# EAGLE design M220xc (EAGLE 6.6.0)
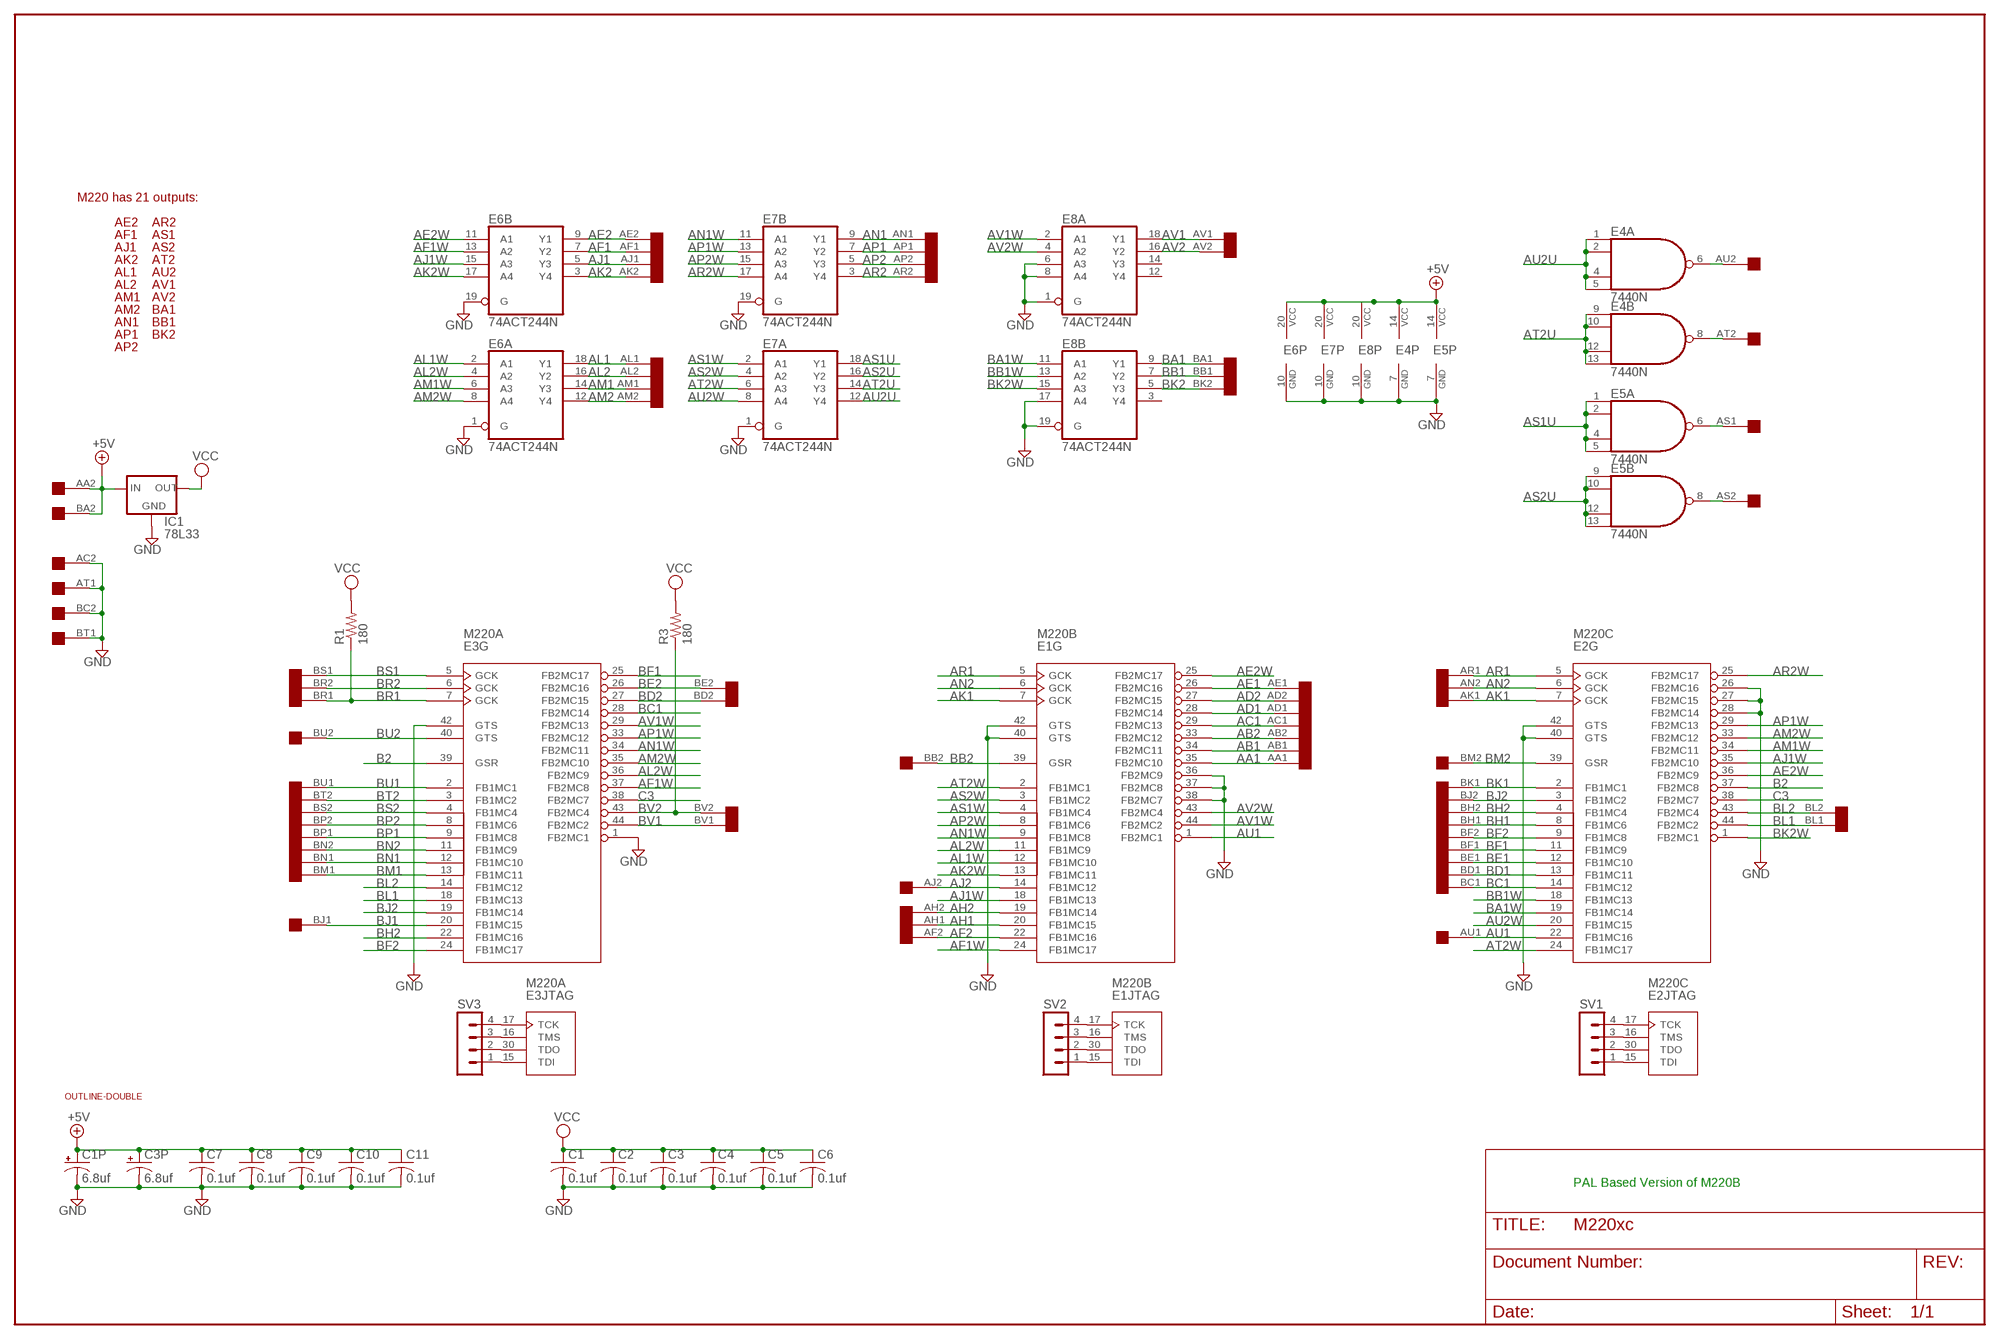
[diagram p0: schematic, sheet 1]

## Parts
C1  0.1uf  C-US050-025X075  [C050-025X075]
C1P  6.8uf  CPOL-USE15-5AXIAL  [E15-5]
C2  0.1uf  C-US050-025X075  [C050-025X075]
C3  0.1uf  C-US050-025X075  [C050-025X075]
C3P  6.8uf  CPOL-USE15-5AXIAL  [E15-5]
C4  0.1uf  C-US050-025X075  [C050-025X075]
C5  0.1uf  C-US050-025X075  [C050-025X075]
C6  0.1uf  C-US050-025X075  [C050-025X075]
C7  0.1uf  C-US050-025X075  [C050-025X075]
C8  0.1uf  C-US050-025X075  [C050-025X075]
C9  0.1uf  C-US050-025X075  [C050-025X075]
C10  0.1uf  C-US050-025X075  [C050-025X075]
C11  0.1uf  C-US050-025X075  [C050-025X075]
E1  M220B  XC9536-44  [PLCC-S44]
E2  M220C  XC9536-44  [PLCC-S44]
E3  M220A  XC9536-44  [PLCC-S44]
E4  7440N  74S20N  [DIL14]
E5  7440N  74S20N  [DIL14]
E6  74ACT244N  74S244N  [DIL20]
E7  74ACT244N  74S244N  [DIL20]
E8  74ACT244N  74S244N  [DIL20]
IC1  78L33  78LXX  [78LXX]
R1  180  R-US_0207/10  [0207/10]
R3  180  R-US_0207/10  [0207/10]
SV1  MA04-1  [MA04-1]
SV2  MA04-1  [MA04-1]
SV3  MA04-1  [MA04-1]
U$1  DOUBLE  [EDGE-CON4]
U$2  OUTLINE-DOUBLE  [DOUBLE]

## Nets
+5V [Supply]: C1P.+ C3P.+ C7.1 C8.1 C9.1 C10.1 C11.1 E4.14(P:VCC) E5.14(P:VCC) E6.20(P:VCC) E7.20(P:VCC) E8.20(P:VCC) IC1.IN U$1.AA2 U$1.BA2
AA1: E1.35(G:FB2MC10) U$1.AA1
AB1: E1.34(G:FB2MC11) U$1.AB1
AB2: E1.33(G:FB2MC12) U$1.AB2
AC1: E1.29(G:FB2MC13) U$1.AC1
AD1: E1.28(G:FB2MC14) U$1.AD1
AD2: E1.27(G:FB2MC15) U$1.AD2
AE1: E1.26(G:FB2MC16) U$1.AE1
AE2: E6.9(B:Y1) U$1.AE2
AE2W: E1.25(G:FB2MC17) E2.36(G:FB2MC9) E6.11(B:A1)
AF1: E6.7(B:Y2) U$1.AF1
AF1W: E1.24(G:FB1MC17) E3.37(G:FB2MC8) E6.13(B:A2)
AF2: E1.22(G:FB1MC16) U$1.AF2
AH1: E1.20(G:FB1MC15) U$1.AH1
AH2: E1.19(G:FB1MC14) U$1.AH2
AJ1: E6.5(B:Y3) U$1.AJ1
AJ1W: E1.18(G:FB1MC13) E2.35(G:FB2MC10) E6.15(B:A3)
AJ2: E1.14(G:FB1MC12) U$1.AJ2
AK1: E1.7(G:GCK) E2.7(G:GCK) U$1.AK1
AK2: E6.3(B:Y4) U$1.AK2
AK2W: E1.13(G:FB1MC11) E6.17(B:A4)
AL1: E6.18(A:Y1) U$1.AL1
AL1W: E1.12(G:FB1MC10) E6.2(A:A1)
AL2: E6.16(A:Y2) U$1.AL2
AL2W: E1.11(G:FB1MC9) E3.36(G:FB2MC9) E6.4(A:A2)
AM1: E6.14(A:Y3) U$1.AM1
AM1W: E2.34(G:FB2MC11) E6.6(A:A3)
AM2: E6.12(A:Y4) U$1.AM2
AM2W: E2.33(G:FB2MC12) E3.35(G:FB2MC10) E6.8(A:A4)
AN1: E7.9(B:Y1) U$1.AN1
AN1W: E1.9(G:FB1MC8) E3.34(G:FB2MC11) E7.11(B:A1)
AN2: E1.6(G:GCK) E2.6(G:GCK) U$1.AN2
AP1: E7.7(B:Y2) U$1.AP1
AP1W: E2.29(G:FB2MC13) E3.33(G:FB2MC12) E7.13(B:A2)
AP2: E7.5(B:Y3) U$1.AP2
AP2W: E1.8(G:FB1MC6) E7.15(B:A3)
AR1: E1.5(G:GCK) E2.5(G:GCK) U$1.AR1
AR2: E7.3(B:Y4) U$1.AR2
AR2W: E2.25(G:FB2MC17) E7.17(B:A4)
AS1: E5.6(A:O) U$1.AS1
AS1U: E5.1(A:I0) E5.2(A:I1) E5.4(A:I2) E5.5(A:I3) E7.18(A:Y1)
AS1W: E1.4(G:FB1MC4) E7.2(A:A1)
AS2: E5.8(B:O) U$1.AS2
AS2U: E5.9(B:I0) E5.10(B:I1) E5.12(B:I2) E5.13(B:I3) E7.16(A:Y2)
AS2W: E1.3(G:FB1MC2) E7.4(A:A2)
AT2: E4.8(B:O) U$1.AT2
AT2U: E4.9(B:I0) E4.10(B:I1) E4.12(B:I2) E4.13(B:I3) E7.14(A:Y3)
AT2W: E1.2(G:FB1MC1) E2.24(G:FB1MC17) E7.6(A:A3)
AU1: E1.1(G:FB2MC1) E2.22(G:FB1MC16) U$1.AU1
AU2: E4.6(A:O) U$1.AU2
AU2U: E4.1(A:I0) E4.2(A:I1) E4.4(A:I2) E4.5(A:I3) E7.12(A:Y4)
AU2W: E2.20(G:FB1MC15) E7.8(A:A4)
AV1: E8.18(A:Y1) U$1.AV1
AV1W: E1.44(G:FB2MC2) E3.29(G:FB2MC13) E8.2(A:A1)
AV2: E8.16(A:Y2) U$1.AV2
AV2W: E1.43(G:FB2MC4) E8.4(A:A2)
B2: E2.37(G:FB2MC8) E3.39(G:GSR)
BA1: E8.9(B:Y1) U$1.BA1
BA1W: E2.19(G:FB1MC14) E8.11(B:A1)
BB1: E8.7(B:Y2) U$1.BB1
BB1W: E2.18(G:FB1MC13) E8.13(B:A2)
BB2: E1.39(G:GSR) U$1.BB2
BC1: E2.14(G:FB1MC12) E3.28(G:FB2MC14) U$1.BC1
BD1: E2.13(G:FB1MC11) U$1.BD1
BD2: E3.27(G:FB2MC15) U$1.BD2
BE1: E2.12(G:FB1MC10) U$1.BE1
BE2: E3.26(G:FB2MC16) U$1.BE2
BF1: E2.11(G:FB1MC9) E3.25(G:FB2MC17) U$1.BF1
BF2: E2.9(G:FB1MC8) E3.24(G:FB1MC17) U$1.BF2
BH1: E2.8(G:FB1MC6) U$1.BH1
BH2: E2.4(G:FB1MC4) E3.22(G:FB1MC16) U$1.BH2
BJ1: E3.20(G:FB1MC15) U$1.BJ1
BJ2: E2.3(G:FB1MC2) E3.19(G:FB1MC14) U$1.BJ2
BK1: E2.2(G:FB1MC1) U$1.BK1
BK2: E8.5(B:Y3) U$1.BK2
BK2W: E2.1(G:FB2MC1) E8.15(B:A3)
BL1: E2.44(G:FB2MC2) E3.18(G:FB1MC13) U$1.BL1
BL2: E2.43(G:FB2MC4) E3.14(G:FB1MC12) U$1.BL2
BM1: E3.13(G:FB1MC11) U$1.BM1
BM2: E2.39(G:GSR) U$1.BM2
BN1: E3.12(G:FB1MC10) U$1.BN1
BN2: E3.11(G:FB1MC9) U$1.BN2
BP1: E3.9(G:FB1MC8) U$1.BP1
BP2: E3.8(G:FB1MC6) U$1.BP2
BR1: E3.7(G:GCK) R1.1 U$1.BR1
BR2: E3.6(G:GCK) U$1.BR2
BS1: E3.5(G:GCK) U$1.BS1
BS2: E3.4(G:FB1MC4) U$1.BS2
BT2: E3.3(G:FB1MC2) U$1.BT2
BU1: E3.2(G:FB1MC1) U$1.BU1
BU2: E3.40(G:GTS) U$1.BU2
BV1: E3.44(G:FB2MC2) U$1.BV1
BV2: E3.43(G:FB2MC4) R3.1 U$1.BV2
C3: E2.38(G:FB2MC7) E3.38(G:FB2MC7)
GND [Supply]: C1.2 C1P.- C2.2 C3.2 C3P.- C4.2 C5.2 C6.2 C7.2 C8.2 C9.2 C10.2 C11.2 E1.36(G:FB2MC9) E1.37(G:FB2MC8) E1.38(G:FB2MC7) E1.40(G:GTS) E1.42(G:GTS) E2.26(G:FB2MC16) E2.27(G:FB2MC15) E2.28(G:FB2MC14) E2.40(G:GTS) E2.42(G:GTS) E3.1(G:FB2MC1) E3.42(G:GTS) E4.7(P:GND) E5.7(P:GND) E6.1(A:G) E6.10(P:GND) E6.19(B:G) E7.1(A:G) E7.10(P:GND) E7.19(B:G) E8.1(A:G) E8.6(A:A3) E8.8(A:A4) E8.10(P:GND) E8.17(B:A4) E8.19(B:G) IC1.GND U$1.AC2 U$1.AT1 U$1.BC2 U$1.BT1
N$1: E1.15(JTAG:TDI) SV2.1
N$2: E1.30(JTAG:TDO) SV2.2
N$3: E2.15(JTAG:TDI) SV1.1
N$4: E1.16(JTAG:TMS) SV2.3
N$5: E2.30(JTAG:TDO) SV1.2
N$6: E2.16(JTAG:TMS) SV1.3
N$7: E2.17(JTAG:TCK) SV1.4
N$8: E1.17(JTAG:TCK) SV2.4
N$9: E3.15(JTAG:TDI) SV3.1
N$10: E3.30(JTAG:TDO) SV3.2
N$11: E3.16(JTAG:TMS) SV3.3
N$12: E3.17(JTAG:TCK) SV3.4
VCC [Supply]: C1.1 C2.1 C3.1 C4.1 C5.1 C6.1 IC1.OUT R1.2 R3.2
Unconnected: E8.3(B:Y4) E8.12(A:Y4) E8.14(A:Y3)

## Notes on the sheet
- M220 has 21 outputs:
- AE2 | AR2
- AF1 | AS1
- AJ1 | AS2
- AK2 | AT2
- AL1 | AU2
- AL2 | AV1
- AM1 | AV2
- AM2 | BA1
- AN1 | BB1
- AP1 | BK2
- AP2
- PAL Based Version of M220B

## Power pins joined to a net without a drawn wire
GND: E1.10(PWR:GND) E1.23(PWR:GND) E1.31(PWR:GND) E2.10(PWR:GND) E2.23(PWR:GND) E2.31(PWR:GND) E3.10(PWR:GND) E3.23(PWR:GND) E3.31(PWR:GND)
VCC: E1.21(PWR:VCC) E1.32(PWR:VCC) E1.41(PWR:VCC) E2.21(PWR:VCC) E2.32(PWR:VCC) E2.41(PWR:VCC) E3.21(PWR:VCC) E3.32(PWR:VCC) E3.41(PWR:VCC)

## Library data of the parts
C1-C11 = rcl:C-US: CAPACITOR, American symbol
C1P C3P = rcl:CPOL-US: POLARIZED CAPACITOR, American symbol
E1-E3 = dec-con:XC9536-44
E4 E5 = 74xx-us:74*20: Dual 4-input NAND gate
E6-E8 = 74xx-us:74*244: Octal BUFFER and LINE DRIVER, 3-state
IC1 = v-reg:78LXX: VOLTAGE REGULATOR
R1 R3 = rcl:R-US_: RESISTOR, American symbol
SV1-SV3 = con-lstb:MA04-1: PIN HEADER; OC_FARNELL: unknown; OC_NEWARK: unknown
U$1 = dec-con:DOUBLE: Double-Height DEC board
U$2 = dec-con:OUTLINE-*: Board outlines for DEC boards.

## Net classes
1 Supply: width 0.813 mm

## Board
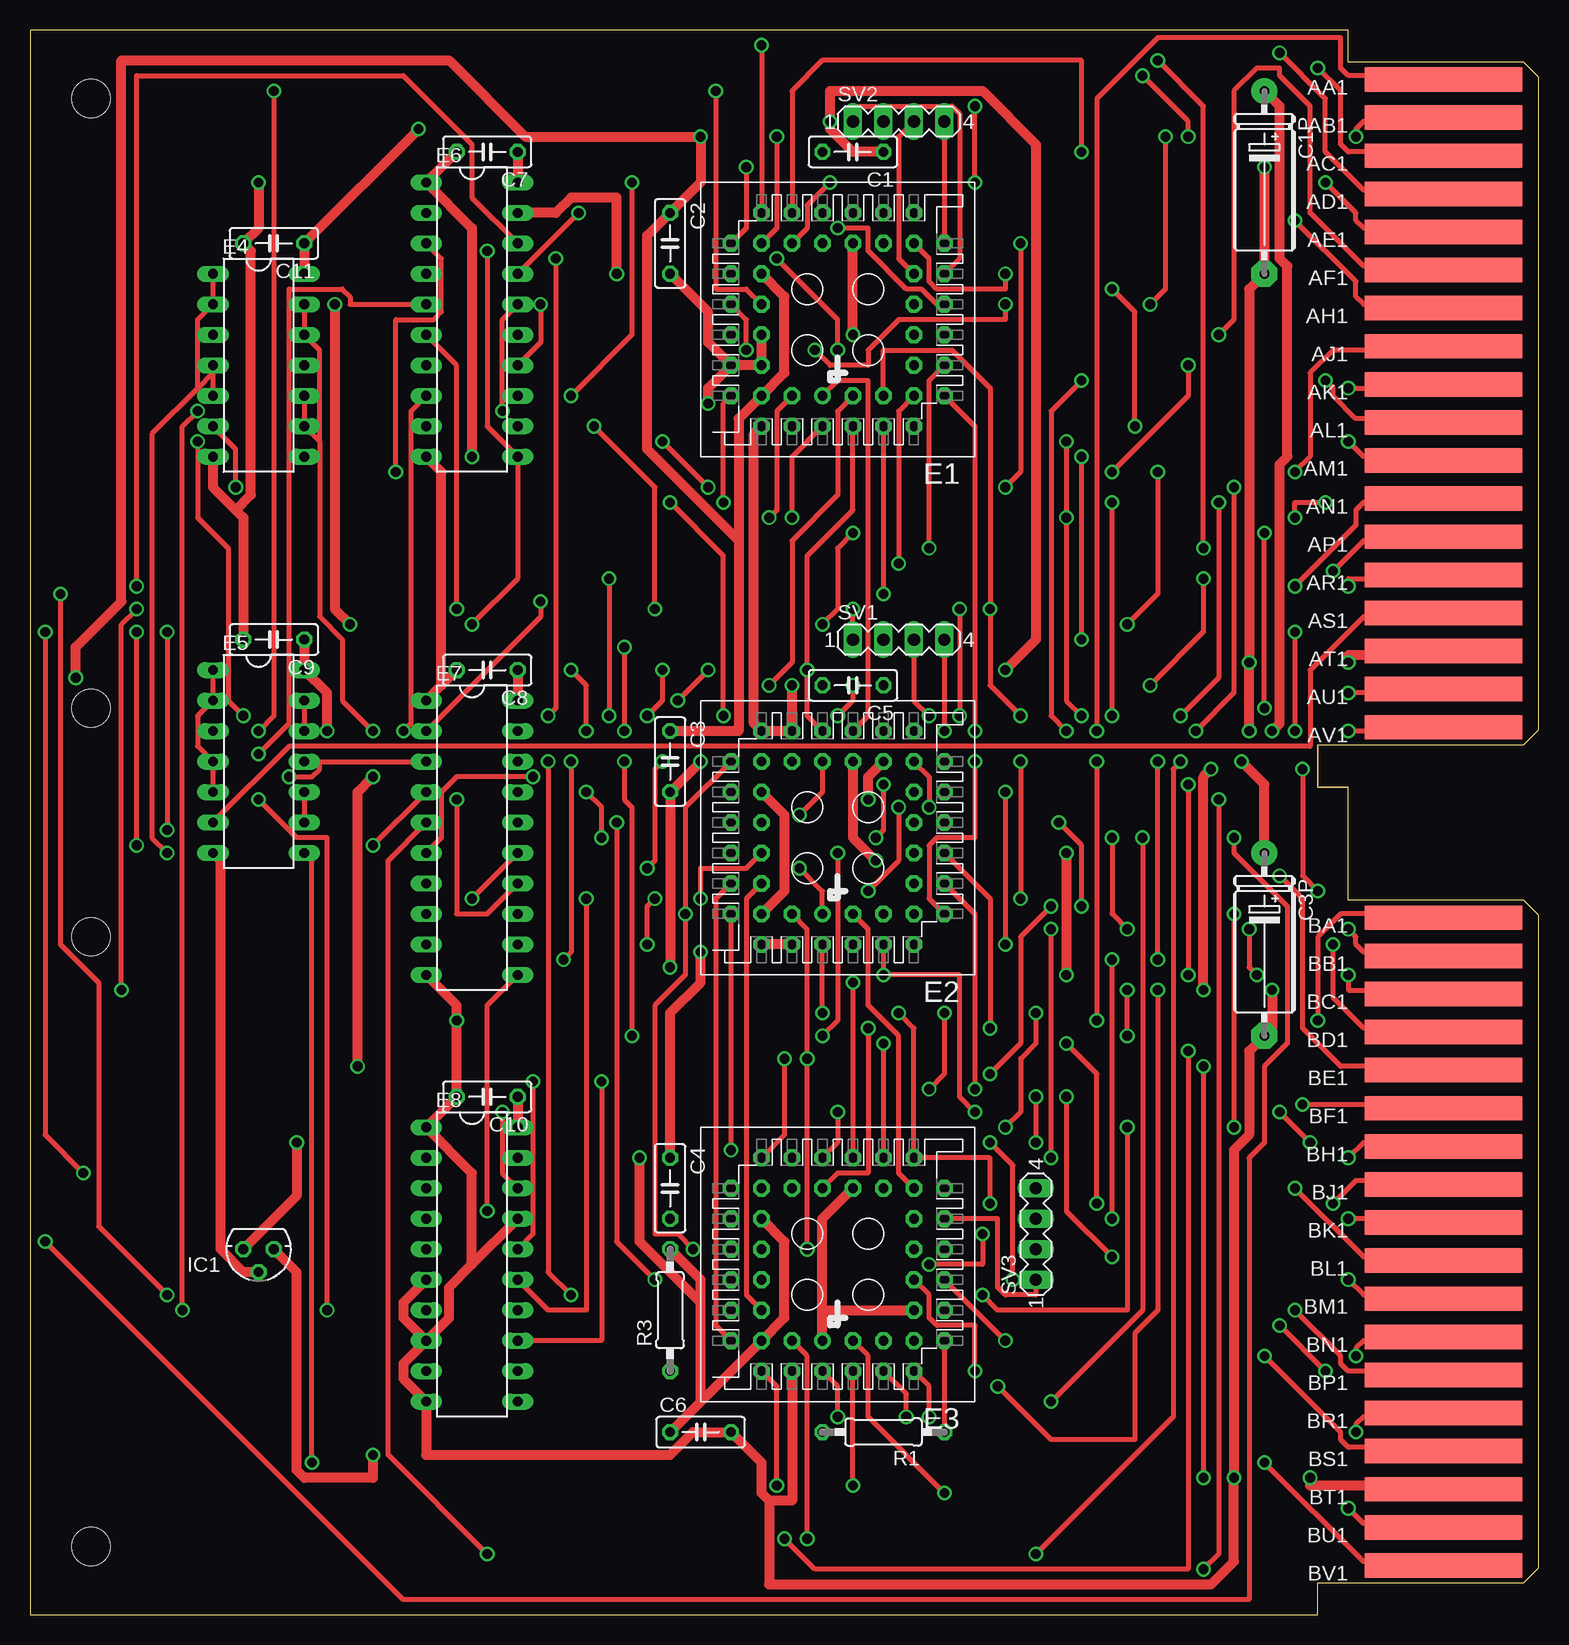
[diagram p1: board, top side]
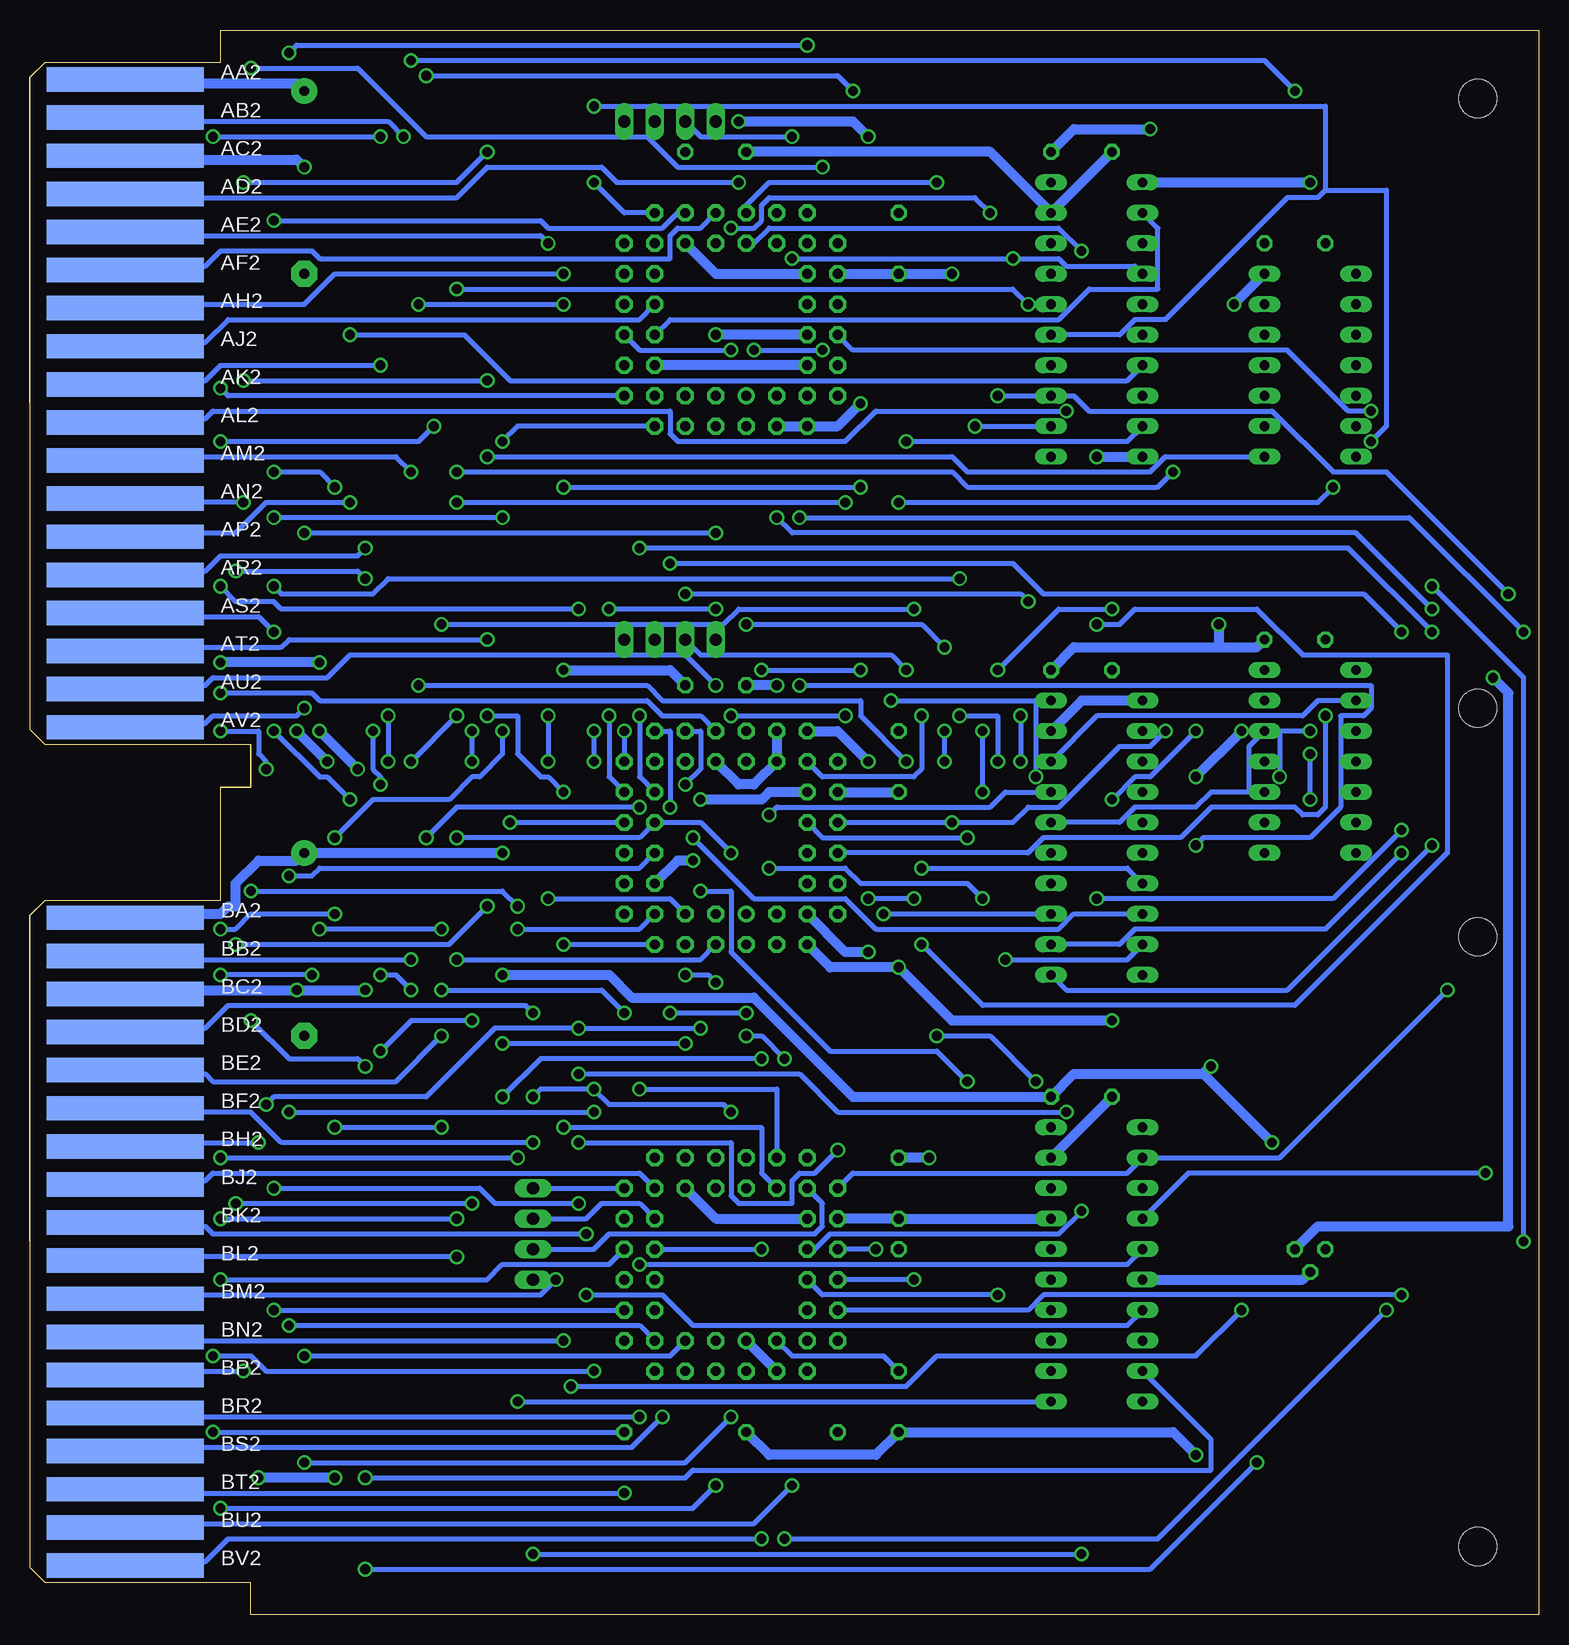
[diagram p2: board, bottom side, seen from below]

Size 125.73 x 132.08 mm. Coordinates in mm from the lower left corner, seen from the top.
Copper layers (1+16): Top 0.035mm / dielectric 1.5mm / Bottom 0.035mm
Design rules "16mils": minimum track width 16mil, minimum drill 32mil, track to track 15mil, track to pad 10mil, pad to pad 10mil, via to via 10mil, smd to smd 10mil, copper to edge 13mil, drill to drill 10mil, minimum pad ring 10mil, minimum via ring 8mil, stop-mask expansion 0mil, vias tented up to drill 0mil, thermal gap 10mil

### Footprints (pad centres in the part's own frame; a part is rotated, then mirrored left to right if it is on the bottom)
C050-025X075 = drill 0.813 octagon: 1 -2.54,0; 2 2.54,0
E15-5 = drill 0.813 pad 2.159: + -7.62,0 | drill 0.813 pad 2.159 octagon: - 7.62,0
PLCC-S44 = drill 0.813 pad 1.397: 1 1.27,6.35 | drill 0.813 pad 1.397 octagon: 2 -1.27,8.89; 3 -1.27,6.35; 4 -3.81,8.89; 5 -3.81,6.35; 6 -6.35,8.89; 7 -8.89,6.35; 8 -6.35,6.35; 9 -8.89,3.81; 10 -6.35,3.81; 11 -8.89,1.27; 12 -6.35,1.27; 13 -8.89,-1.27; 14 -6.35,-1.27; 15 -8.89,-3.81; 16 -6.35,-3.81; 17 -8.89,-6.35; 18 -6.35,-8.89; 19 -6.35,-6.35; 20 -3.81,-8.89; 21 -3.81,-6.35; 22 -1.27,-8.89; 23 -1.27,-6.35; 24 1.27,-8.89; 25 1.27,-6.35; 26 3.81,-8.89; 27 3.81,-6.35; 28 6.35,-8.89; 29 8.89,-6.35; 30 6.35,-6.35; 31 8.89,-3.81; 32 6.35,-3.81; 33 8.89,-1.27; 34 6.35,-1.27; 35 8.89,1.27; 36 6.35,1.27; 37 8.89,3.81; 38 6.35,3.81; 39 8.89,6.35; 40 6.35,8.89; 41 6.35,6.35; 42 3.81,8.89; 43 3.81,6.35; 44 1.27,8.89
DIL14 = drill 0.813 long: 1 -7.62,-3.81; 2 -5.08,-3.81; 3 -2.54,-3.81; 4 0,-3.81; 5 2.54,-3.81; 6 5.08,-3.81; 7 7.62,-3.81; 8 7.62,3.81; 9 5.08,3.81; 10 2.54,3.81; 11 0,3.81; 12 -2.54,3.81; 13 -5.08,3.81; 14 -7.62,3.81
DIL20 = drill 0.813 long: 1 -11.43,-3.81; 2 -8.89,-3.81; 3 -6.35,-3.81; 4 -3.81,-3.81; 5 -1.27,-3.81; 6 1.27,-3.81; 7 3.81,-3.81; 8 6.35,-3.81; 9 8.89,-3.81; 10 11.43,-3.81; 11 11.43,3.81; 12 8.89,3.81; 13 6.35,3.81; 14 3.81,3.81; 15 1.27,3.81; 16 -1.27,3.81; 17 -3.81,3.81; 18 -6.35,3.81; 19 -8.89,3.81; 20 -11.43,3.81
78LXX = drill 0.813 octagon: GND 0,1.905; IN 1.27,0; OUT -1.27,0
0207/10 = drill 0.813 octagon: 1 -5.08,0; 2 5.08,0
MA04-1 = drill 1.016 long: 1 -3.81,0; 2 -1.27,0; 3 1.27,0; 4 3.81,0
EDGE-CON4 = smd 13.106 x 2.032: AA1 7.938,4.128; AB1 7.938,7.303; AC1 7.938,10.477; AD1 7.938,13.652; AE1 7.938,16.828; AF1 7.938,20.003; AH1 7.938,23.177; AJ1 7.938,26.352; AK1 7.938,29.527; AL1 7.938,32.703; AM1 7.938,35.877; AN1 7.938,39.053; AP1 7.938,42.227; AR1 7.938,45.403; AS1 7.938,48.578; AT1 7.938,51.752; AU1 7.938,54.928; AV1 7.938,58.102; BA1 7.938,73.978; BB1 7.938,77.153; BC1 7.938,80.328; BD1 7.938,83.502; BE1 7.938,86.677; BF1 7.938,89.853; BH1 7.938,93.028; BJ1 7.938,96.203; BK1 7.938,99.377; BL1 7.938,102.552; BM1 7.938,105.728; BN1 7.938,108.903; BP1 7.938,112.078; BR1 7.938,115.252; BS1 7.938,118.427; BT1 7.938,121.603; BU1 7.938,124.778; BV1 7.938,127.953 | smd 13.106 x 2.032 bottom: AA2 7.938,4.128; AB2 7.938,7.303; AC2 7.938,10.477; AD2 7.938,13.652; AE2 7.938,16.828; AF2 7.938,20.003; AH2 7.938,23.177; AJ2 7.938,26.352; AK2 7.938,29.527; AL2 7.938,32.703; AM2 7.938,35.877; AN2 7.938,39.053; AP2 7.938,42.227; AR2 7.938,45.403; AS2 7.938,48.578; AT2 7.938,51.752; AU2 7.938,54.928; AV2 7.938,58.102; BA2 7.938,73.978; BB2 7.938,77.153; BC2 7.938,80.328; BD2 7.938,83.502; BE2 7.938,86.677; BF2 7.938,89.853; BH2 7.938,93.028; BJ2 7.938,96.203; BK2 7.938,99.377; BL2 7.938,102.552; BM2 7.938,105.728; BN2 7.938,108.903; BP2 7.938,112.078; BR2 7.938,115.252; BS2 7.938,118.427; BT2 7.938,121.603; BU2 7.938,124.778; BV2 7.938,127.953
DOUBLE = hole 3.175: 120.65,56.515; 120.65,5.715; 120.65,75.565; 120.65,126.365

### Placement (x,y rotation side)
C1  68.58,121.92 180 top
C1P  102.87,119.38 270 top
C2  53.34,114.3 270 top
C3  53.34,71.12 270 top
C3P  102.87,55.88 270 top
C4  53.34,35.56 270 top
C5  68.58,77.47 180 top
C6  55.88,15.24 0 top
C7  38.1,121.92 180 top
C8  38.1,78.74 180 top
C9  20.32,81.28 180 top
C10  38.1,43.18 180 top
C11  20.32,114.3 180 top
E1  67.31,107.95 180 top
E2  67.31,64.77 180 top
E3  67.31,29.21 180 top
E4  19.05,104.14 270 top
E5  19.05,71.12 270 top
E6  36.83,107.95 270 top
E7  36.83,64.77 270 top
E8  36.83,29.21 270 top
IC1  19.05,30.48 180 top
R1  71.12,15.24 180 top
R3  53.34,25.4 90 top
SV1  72.39,81.28 0 top
SV2  72.39,124.46 0 top
SV3  83.82,31.75 90 top
U$1  125.73,132.08 180 top
U$2  125.73,132.08 180 top

### Tracks (layer width: path | path; a pad name or v marks a point on that pad's centre or on a via)
+5V  (via drill 0.81)
  Top 0.813: C9.1 E5.14 24.77,76.83 v24.77,73.66 | C8.1 E7.20 | E4.14 C11.1 v32.38,123.83 | C7.1 E6.20 | v26.67,82.55 25.4,83.82 v25.4,109.22 | IC1.IN 22.23,34.92 v22.23,39.37 | C10.1 E8.20 | v86.36,63.5 v86.36,53.34 | C1P.+ 104.14,125.73 104.14,113.03 104.78,112.39 104.78,96.52 104.14,95.89 104.14,74.3 v103.5,73.66 | v100.97,71.12 102.87,69.22 C3P.+ | v28.57,69.85 27.3,68.58 v27.3,45.72
  Bottom 0.813: C9.1 23.5,80.64 26.67,80.64 | 26.67,80.64 38.73,80.64 C8.1 | v32.38,123.83 38.73,123.83 C7.1 | v26.67,82.55 26.67,80.64 | E4.14 v25.4,109.22 | C1P.+ 103.5,127.64 117.47,127.64 U$1.AA2 | 27.94,45.09 v22.23,39.37 | 27.94,45.09 38.73,45.09 C10.1 57.15,43.18 65.41,51.44 75.56,51.44 77.47,53.34 v86.36,53.34 | U$1.BA2 117.47,58.42 109.86,58.42 109.22,59.05 108.58,59.05 108.58,60.96 106.68,62.87 103.5,62.87 C3P.+ v86.36,63.5 | v100.97,71.12 v103.5,73.66 | v28.57,69.85 v24.77,73.66 | 27.94,45.09 v27.3,45.72
AA1  (via drill 0.81)
  Top 0.406: v13.97,100.33 12.7,99.06 v12.7,25.4 | v62.87,6.35 65.41,3.81 96.52,3.81 v96.52,46.99 | v88.9,71.12 v88.9,49.53 | v88.9,73.66 88.9,126.36 93.98,131.44 109.22,131.44 109.22,128.91 109.86,128.27 117.47,128.27 U$1.AA1
  Bottom 0.406: E1.35 57.15,105.41 20.95,105.41 15.88,100.33 v13.97,100.33 | v12.7,25.4 31.75,6.35 v62.87,6.35 | v96.52,46.99 93.98,49.53 v88.9,49.53 | v88.9,73.66 v88.9,71.12
AB1  (via drill 0.81)
  Top 0.406: E1.34 59.69,110.49 57.15,110.49 v57.15,127 | v92.71,128.27 96.52,124.46 v96.52,123.19 | v110.49,123.19 110.49,123.83 111.12,124.46 117.47,124.46 U$1.AB1
  Bottom 0.406: v57.15,127 58.42,128.27 v92.71,128.27 | v110.49,123.19 v96.52,123.19
AB2  (via drill 0.81)
  Top 0.406: E1.33 59.69,107.95 v59.69,105.41 | v65.41,105.41 66.67,104.14 69.85,104.14 69.85,105.41 72.39,107.95 81.28,107.95 v81.28,109.22 | v93.34,109.22 94.61,110.49 v94.61,123.19
  Bottom 0.406: v65.41,105.41 v59.69,105.41 | v93.34,109.22 v81.28,109.22 | v94.61,123.19 95.89,124.46 117.47,124.46 U$1.AB2
AC1  (via drill 0.81)
  Top 0.406: E1.29 59.69,115.57 v59.69,120.65 | v107.31,128.91 109.22,127 109.22,122.56 109.86,121.92 117.47,121.92 U$1.AC1
  Bottom 0.406: v59.69,120.65 71.75,120.65 74.3,123.19 92.71,123.19 98.42,128.91 v107.31,128.91
AD1  (via drill 0.81)
  Top 0.406: v60.96,130.81 E1.28 | v104.14,130.18 107.95,126.36 107.95,121.92 111.12,118.75 117.47,118.75 U$1.AD1
  Bottom 0.406: v60.96,130.81 103.5,130.81 v104.14,130.18
AD2  (via drill 0.81)
  Top 0.406: E1.27 64.77,115.57 64.77,117.47 v66.67,119.38
  Bottom 0.406: v66.67,119.38 76.83,119.38 78.11,120.65 87.63,120.65 90.17,118.11 117.47,118.11 U$1.AD2
AE1  (via drill 0.81)
  Top 0.406: E1.26 63.5,127 66.04,129.54 87.63,129.54 v87.63,121.92 | v107.95,119.38 110.49,116.84 110.49,116.2 111.12,115.57 117.47,115.57 U$1.AE1
  Bottom 0.406: v87.63,121.92 90.17,119.38 v107.95,119.38
AE2  (via drill 0.81)
  Top 0.406: v56.52,93.98 v52.7,97.79 | v81.28,93.98 82.55,95.25 v82.55,114.3
  Bottom 0.406: E6.9 34.29,97.79 v52.7,97.79 | v81.28,93.98 v56.52,93.98 | v82.55,114.3 83.19,114.94 117.47,114.94 U$1.AE2
AE2W  (via drill 0.81)
  Top 0.406: v38.1,113.67 38.1,99.06 E6.11 40.64,86.36 v36.83,82.55 | E2.36 59.69,62.23 55.88,62.23 v55.88,59.69 | v52.07,59.69 51.44,59.05 v51.44,55.88
  Bottom 0.406: v38.1,113.67 40.01,115.57 64.14,115.57 65.41,114.3 E1.25 | v52.07,59.69 v55.88,59.69 | v51.44,55.88 46.35,50.8 20.32,50.8 7.62,63.5 7.62,80.01 19.68,80.01 23.5,83.82 33.66,83.82 34.92,82.55 v36.83,82.55
AF1  (via drill 0.81)
  Top 0.406: v99.06,106.68 100.33,107.95 100.33,127 102.23,128.91 104.14,128.91 104.14,128.27 106.68,125.73 106.68,116.84 111.12,112.39 117.47,112.39 U$1.AF1
  Bottom 0.406: E6.7 34.29,102.87 85.72,102.87 89.53,106.68 v99.06,106.68
AF1W  (via drill 0.81)
  Top 0.406: v45.09,101.6 50.16,106.68 v50.16,119.38 | v11.43,26.67 5.71,32.38 5.71,52.7 2.54,55.88 v2.54,85.09
  Bottom 0.406: v45.09,101.6 E6.13 38.73,101.6 37.47,100.33 22.23,100.33 17.14,95.25 12.7,95.25 v2.54,85.09 | v50.16,119.38 64.14,119.38 66.04,117.47 E1.24 | E3.37 42.55,25.4 41.27,26.67 v11.43,26.67
AF2
  Bottom 0.406: E1.22 69.85,115.57 71.75,115.57 72.39,114.94 72.39,113.03 101.6,113.03 102.23,113.67 109.86,113.67 111.12,112.39 117.47,112.39 U$1.AF2
AH1  (via drill 0.81)
  Top 0.406: v105.41,116.2 110.49,111.12 110.49,109.86 111.12,109.22 117.47,109.22 U$1.AH1
  Bottom 0.406: E1.20 71.75,116.84 73.03,115.57 82.55,115.57 83.19,116.2 v105.41,116.2
AH2  (via drill 0.81)
  Top 0.406: E1.19 74.93,113.03 74.93,111.12 75.56,110.49 81.28,110.49 v81.28,111.76
  Bottom 0.406: v81.28,111.76 100.33,111.76 102.87,109.22 117.47,109.22 U$1.AH2
AJ1  (via drill 0.81)
  Top 0.406: E6.5 26.67,109.22 26.67,109.86 26.04,110.49 21.59,110.49 21.59,74.3 v19.05,71.75 | v19.05,67.94 22.23,64.77 24.77,64.77 v24.77,25.4 | v80.64,19.05 85.09,14.61 92.08,14.61 92.08,23.5 93.98,25.4 v93.98,52.07 | v96.52,69.22 v96.52,53.34 | v97.16,73.66 100.33,76.83 v100.33,93.98 | v105.41,95.25 106.68,96.52 106.68,103.5 108.58,105.41 117.47,105.41 U$1.AJ1
  Bottom 0.406: v19.05,67.94 v19.05,71.75 | v24.77,25.4 28.57,21.59 50.16,21.59 52.7,19.05 v80.64,19.05 | v93.98,52.07 95.25,53.34 v96.52,53.34 | v96.52,69.22 96.52,69.85 97.16,70.48 v97.16,73.66 | v100.33,93.98 101.6,95.25 v105.41,95.25
AJ1W  (via drill 0.81)
  Top 0.406: v78.74,119.38 v78.74,125.73 | v17.78,74.93 16.51,76.2 16.51,88.9 13.97,91.44 v13.97,97.79
  Bottom 0.406: E6.15 34.92,106.68 33.66,107.95 31.11,107.95 20.95,118.11 18.41,118.11 17.78,118.75 | 17.78,118.75 17.78,125.73 v78.74,125.73 | v78.74,119.38 76.2,116.84 E1.18 | E2.35 42.55,63.5 41.27,64.77 29.84,64.77 27.3,67.31 20.32,67.31 19.68,66.67 18.41,66.67 17.78,67.31 v17.78,74.93 | v13.97,97.79 12.7,99.06 12.7,118.75 17.78,118.75
AJ2
  Bottom 0.406: E1.14 74.93,107.95 109.22,107.95 111.12,106.05 117.47,106.05 U$1.AJ2
AK1  (via drill 0.81)
  Top 0.406: E2.7 74.93,59.69 74.93,64.14 75.56,64.77 78.74,64.77 v78.74,71.12 | v78.74,73.66 78.74,99.06 E1.7 | v109.86,102.23 117.47,102.23 U$1.AK1
  Bottom 0.406: v78.74,73.66 v78.74,71.12 | v109.86,102.23 109.22,101.6 E1.7
AK2  (via drill 0.81)
  Top 0.406: E6.3 34.29,113.03 34.29,108.58 33.66,107.95 30.48,107.95 v30.48,95.25 | v90.17,95.25 96.52,101.6 v96.52,104.14
  Bottom 0.406: v30.48,95.25 31.75,93.98 47.62,93.98 48.9,95.25 v90.17,95.25 | v96.52,104.14 109.86,104.14 111.12,102.87 117.47,102.87 U$1.AK2
AK2W  (via drill 0.81)
  Top 0.406: v45.72,116.84 E6.17 | v67.31,115.57 69.85,115.57 69.85,113.67 73.03,110.49 74.3,110.49 75.56,109.22 E1.13
  Bottom 0.406: v45.72,116.84 46.99,118.11 64.14,118.11 64.77,117.47 64.77,116.2 65.41,115.57 v67.31,115.57
AL1  (via drill 0.81)
  Top 0.406: E6.18 36.83,118.11 36.83,122.56 31.11,128.27 8.89,128.27 v8.89,85.72 | v1.27,31.11 31.11,1.27 101.6,1.27 101.6,38.1 102.87,39.37 102.87,45.72 104.78,47.62 104.78,59.05 100.33,63.5 v100.33,64.77 | v86.36,73.66 85.09,74.93 85.09,100.33 v87.63,102.87 | v107.95,102.87 108.58,102.23 108.58,101.6 110.49,99.69 117.47,99.69 U$1.AL1
  Bottom 0.406: v8.89,85.72 1.27,78.11 v1.27,31.11 | v100.33,64.77 97.16,67.94 90.81,67.94 88.9,69.85 88.27,69.85 86.36,71.75 v86.36,73.66 | v107.95,102.87 v87.63,102.87
AL1W
  Bottom 0.406: E6.2 31.75,115.57 31.75,110.49 37.47,110.49 40.01,107.95 72.39,107.95 E1.12
AL2  (via drill 0.81)
  Top 0.406: E6.16 39.37,107.95 v39.37,100.33
  Bottom 0.406: v39.37,100.33 55.24,100.33 57.78,97.79 71.75,97.79 72.39,98.42 72.39,100.33 110.49,100.33 111.12,99.69 117.47,99.69 U$1.AL2
AL2W  (via drill 0.81)
  Top 0.406: v62.23,113.03 67.31,107.95 v67.31,105.41 | v45.09,26.67 43.18,28.57 v43.18,71.12 | v43.18,74.93 43.81,75.56 v43.81,113.03
  Bottom 0.406: E6.4 33.66,112.39 39.37,112.39 40.01,113.03 v43.81,113.03 v62.23,113.03 | v67.31,105.41 74.93,105.41 E1.11 | E3.36 59.69,26.67 v45.09,26.67 | v43.18,74.93 v43.18,71.12
AM1  (via drill 0.81)
  Top 0.406: E6.14 42.55,106.05 v42.55,109.22 | v90.17,110.49 92.08,108.58 v92.08,99.06 | v109.86,97.79 111.12,96.52 117.47,96.52 U$1.AM1
  Bottom 0.406: v42.55,109.22 43.81,110.49 v90.17,110.49 | v92.08,99.06 93.34,97.79 v109.86,97.79
AM1W  (via drill 0.81)
  Top 0.406: E6.6 35.56,104.14 v35.56,83.82 | v45.09,78.74 46.35,77.47 v46.35,73.66 | v46.35,68.58 47.62,67.31 v47.62,64.77
  Bottom 0.406: v35.56,83.82 40.01,83.82 v45.09,78.74 | v46.35,68.58 v46.35,73.66 | v47.62,64.77 59.69,64.77 E2.34
AM2  (via drill 0.81)
  Top 0.406: v46.99,99.06 52.07,93.98 v52.07,83.82 | v91.44,82.55 93.98,85.09 v93.98,95.25
  Bottom 0.406: v46.99,99.06 E6.12 | v52.07,83.82 66.67,83.82 67.94,82.55 v91.44,82.55 | v93.98,95.25 95.25,96.52 117.47,96.52 U$1.AM2
AM2W  (via drill 0.81)
  Top 0.406: E6.8 31.75,100.33 31.75,74.3 v31.11,73.66 | v52.07,27.94 48.9,31.11 v48.9,66.04
  Bottom 0.406: v31.11,73.66 32.38,72.39 34.92,72.39 40.01,67.31 42.55,67.31 43.81,66.04 v48.9,66.04 E2.33 | v52.07,27.94 E3.35
AN1  (via drill 0.81)
  Top 0.406: v44.45,54.61 45.09,55.24 v45.09,71.12 | v48.26,86.36 v48.26,74.93 | v105.41,85.72 110.49,90.81 110.49,92.08 111.12,92.71 117.47,92.71 U$1.AN1
  Bottom 0.406: E7.9 34.29,54.61 v44.45,54.61 | v45.09,71.12 45.09,74.93 v48.26,74.93 | v48.26,86.36 95.89,86.36 97.16,85.09 104.78,85.09 v105.41,85.72
AN1W  (via drill 0.81)
  Top 0.406: E7.11 38.1,50.8 v38.1,33.66 | E1.9 74.93,102.87 v74.93,88.9 | v8.89,64.14 v8.89,81.92
  Bottom 0.406: v38.1,33.66 40.01,31.75 59.05,31.75 60.33,30.48 E3.34 | v74.93,88.9 15.88,88.9 v8.89,81.92 | v8.89,64.14 20.95,52.07 39.37,52.07 E7.11
AN2  (via drill 0.81)
  Top 0.406: v81.28,68.58 v81.28,55.88 | v87.63,74.93 86.36,76.2 v86.36,91.44 v86.36,97.79 | v107.95,92.71 105.41,92.71 v105.41,91.44
  Bottom 0.406: v81.28,55.88 E2.6 | v81.28,68.58 82.55,69.85 83.19,69.85 85.09,71.75 85.09,74.93 v87.63,74.93 | v86.36,97.79 85.09,99.06 E1.6 | v107.95,92.71 117.47,92.71 U$1.AN2 | v86.36,91.44 v105.41,91.44
AP1  (via drill 0.81)
  Top 0.406: v51.44,62.23 52.07,62.87 52.07,70.48 v52.7,71.12 | v93.34,77.47 97.79,81.92 v97.79,86.36 | v108.58,87 111.12,89.53 117.47,89.53 U$1.AP1
  Bottom 0.406: E7.7 34.29,62.23 v51.44,62.23 | v52.7,71.12 56.52,74.93 56.52,76.2 73.03,76.2 74.3,77.47 v93.34,77.47 | v97.79,86.36 98.42,87 v108.58,87
AP1W  (via drill 0.81)
  Top 0.406: E2.29 54.61,67.31 v54.61,58.42 54.61,53.34 52.07,50.8 52.07,31.75 53.98,31.75 v55.24,30.48
  Bottom 0.406: v54.61,58.42 E7.13 | v55.24,30.48 E3.33
AP2  (via drill 0.81)
  Top 0.406: E7.5 29.84,62.87 29.84,13.34 v38.1,5.08 | v83.82,5.08 95.25,16.51 95.25,70.48 v95.89,71.12 | v95.89,74.93 99.06,78.11 v99.06,92.71
  Bottom 0.406: v83.82,5.08 v38.1,5.08 | v95.89,74.93 v95.89,71.12 | v99.06,92.71 106.05,92.71 108.58,90.17 117.47,90.17 U$1.AP2
AP2W  (via drill 0.81)
  Top 0.406: v36.83,59.69 E7.15 | v11.43,81.92 v11.43,65.41 | v72.39,87.63 72.39,100.33 E1.8
  Bottom 0.406: v36.83,59.69 17.14,59.69 v11.43,65.41 | v11.43,81.92 14.61,85.09 41.27,85.09 43.81,87.63 v72.39,87.63
AR1  (via drill 0.81)
  Top 0.406: v82.55,71.12 v82.55,59.69 | v82.55,74.93 80.01,77.47 v80.01,83.82 80.01,102.23 76.83,105.41 71.12,105.41 E1.5 | v109.86,85.72 109.86,86.36 117.47,86.36 U$1.AR1
  Bottom 0.406: E2.5 72.39,59.69 v82.55,59.69 | v82.55,74.93 v82.55,71.12 | v109.86,85.72 108.58,84.45 105.41,84.45 104.78,83.82 v80.01,83.82
AR2  (via drill 0.81)
  Top 0.406: E7.3 24.13,71.12 24.13,70.48 23.5,69.85 v21.59,69.85 | v19.05,73.66 20.32,74.93 v20.32,127 | v93.98,129.54 97.79,125.73 v97.79,88.9
  Bottom 0.406: v21.59,69.85 21.59,73.66 v19.05,73.66 | v20.32,127 22.86,129.54 v93.98,129.54 | v97.79,88.9 98.42,88.27 109.86,88.27 111.12,87 117.47,87 U$1.AR2
AR2W  (via drill 0.81)
  Top 0.406: v64.14,66.67 66.04,68.58 E2.25
  Bottom 0.406: E7.17 44.45,68.58 45.72,67.31 63.5,67.31 v64.14,66.67
AS1
  Top 0.406: E5.6 21.59,72.39 106.68,72.39 106.68,78.74 111.12,83.19 117.47,83.19 U$1.AS1
AS1U
  Top 0.406: E5.5 E5.4 13.97,72.39 13.97,74.93 E5.2 E5.1
  Bottom 0.406: E7.18 36.83,74.93 19.68,74.93 18.41,76.2 E5.2
AS1W  (via drill 0.81)
  Top 0.406: E7.2 42.55,83.19 v42.55,84.45 | E1.4 v71.12,85.09
  Bottom 0.406: v42.55,84.45 43.18,85.09 v71.12,85.09
AS2  (via drill 0.81)
  Top 0.406: E5.8 23.5,62.87 v23.5,12.7 | v97.79,3.81 99.06,5.08 v99.06,67.94 | v105.41,81.92 v105.41,73.66
  Bottom 0.406: v23.5,12.7 32.38,3.81 v97.79,3.81 | v99.06,67.94 100.97,69.85 101.6,69.85 v105.41,73.66 | v105.41,81.92 106.68,83.19 117.47,83.19 U$1.AS2
AS2U
  Top 0.406: E5.13 E5.12 | E5.10 E5.9
  Bottom 0.406: E7.16 34.92,66.04 33.66,67.31 28.57,67.31 27.3,68.58 24.13,68.58 | E5.10 24.13,68.58 | E5.12 24.13,72.39 24.13,68.58
AS2W  (via drill 0.81)
  Top 0.406: v28.57,64.14 E7.4 | v61.59,77.47 63.5,79.38 63.5,89.53 67.31,93.34 67.31,100.33 E1.3
  Bottom 0.406: v28.57,64.14 27.94,64.77 19.05,64.77 16.51,67.31 16.51,74.93 14.61,74.93 13.97,75.56 13.97,77.47 v61.59,77.47
AT2  (via drill 0.81)
  Top 0.406: v87.63,81.28 v87.63,96.52
  Bottom 0.406: E4.8 31.11,96.52 32.38,95.25 47.62,95.25 48.9,96.52 v87.63,96.52 | v87.63,81.28 104.14,81.28 104.78,80.64 117.47,80.64 U$1.AT2
AT2U  (via drill 0.81)
  Top 0.406: E4.13 E4.12 24.13,105.41 24.13,97.79 | E4.10 E4.9 24.13,97.79 | E7.14 38.1,58.42 35.56,58.42 v35.56,67.94 | v28.57,73.66 26.04,76.2 26.04,81.28 24.13,83.19 24.13,97.79
  Bottom 0.406: v35.56,67.94 33.66,69.85 32.38,69.85 v28.57,73.66
AT2W  (via drill 0.81)
  Top 0.406: E7.6 34.29,64.77 34.29,68.58 35.56,69.85 v41.91,69.85 | v56.52,78.74 v53.98,76.2 | E2.24 64.77,74.93 v64.77,78.74 64.77,88.27 68.58,92.08 E1.2
  Bottom 0.406: v41.91,69.85 41.91,76.2 v53.98,76.2 | v64.77,78.74 v56.52,78.74
AU1  (via drill 0.81)
  Top 0.406: E1.1 67.31,102.87 69.85,102.87 69.85,74.93 E2.22 | v109.86,76.83 117.47,76.83 U$1.AU1
  Bottom 0.406: E2.22 69.85,74.93 73.03,74.93 74.3,76.2 101.6,76.2 102.23,76.83 v109.86,76.83
AU2  (via drill 0.81)
  Top 0.406: E4.6 17.14,97.16 v17.14,93.98 | v53.34,92.71 57.78,88.27 v57.78,74.93 | v67.31,74.93 68.58,76.2 v68.58,77.47
  Bottom 0.406: v17.14,93.98 18.41,92.71 v53.34,92.71 | v67.31,74.93 v57.78,74.93 | v68.58,77.47 71.12,80.01 99.06,80.01 100.97,78.11 110.49,78.11 111.12,77.47 117.47,77.47 U$1.AU2
AU2U  (via drill 0.81)
  Top 0.406: E4.1 E4.2 13.97,107.95 13.97,102.23 | 15.24,103.5 E4.5 | v11.43,63.5 10.16,64.77 10.16,98.42 13.97,102.23 | 15.24,103.5 13.97,102.23 | 15.24,103.5 E4.4
  Bottom 0.406: E7.12 34.92,55.88 33.66,57.15 17.78,57.15 v11.43,63.5
AU2W  (via drill 0.81)
  Top 0.406: v70.48,64.77 71.12,65.41 v71.12,69.22
  Bottom 0.406: E7.8 38.73,58.42 40.01,57.15 55.24,57.15 57.78,59.69 65.41,59.69 v70.48,64.77 | v71.12,69.22 69.85,70.48 69.85,73.66 E2.20
AV1  (via drill 0.81)
  Top 0.406: E8.18 39.37,36.83 v39.37,41.91 | v80.01,45.09 82.55,47.62 82.55,56.52 v85.09,59.05 | v107.31,60.33 106.05,61.59 v106.05,70.48 | v109.86,73.66 117.47,73.66 U$1.AV1
  Bottom 0.406: v39.37,41.91 58.42,41.91 61.59,45.09 v80.01,45.09 | v85.09,59.05 86.36,60.33 v107.31,60.33 | v106.05,70.48 106.05,71.12 106.68,71.75 106.68,73.66 v109.86,73.66
AV1W  (via drill 0.81)
  Top 0.406: E1.44 63.5,96.52 v63.5,91.44 | v8.89,83.82 7.62,82.55 v7.62,52.07
  Bottom 0.406: E3.29 57.15,36.83 34.29,36.83 E8.2 21.59,38.1 v7.62,52.07 | v63.5,91.44 62.23,90.17 15.24,90.17 v8.89,83.82
AV2  (via drill 0.81)
  Top 0.406: E8.16 41.91,31.75 v41.91,44.45 | v50.16,48.26 50.16,67.31 49.53,67.94 v49.53,71.12 | v49.53,80.64 v49.53,73.66 | v66.04,82.55 67.31,83.82 67.31,88.9 v68.58,90.17 | v102.87,75.56 v102.87,90.17
  Bottom 0.406: v41.91,44.45 45.72,48.26 v50.16,48.26 | v49.53,73.66 v49.53,71.12 | v49.53,80.64 51.44,82.55 v66.04,82.55 | v102.87,90.17 v68.58,90.17 | v102.87,75.56 103.5,74.93 110.49,74.93 111.12,74.3 117.47,74.3 U$1.AV2
AV2W  (via drill 0.81)
  Top 0.406: v4.45,36.83 1.27,40.01 v1.27,81.92 | v61.59,91.44 62.23,92.08 62.23,100.33 E1.43
  Bottom 0.406: E8.4 29.21,36.83 v4.45,36.83 | v1.27,81.92 10.79,91.44 v61.59,91.44
B2
  Top 0.406: E3.39 57.15,24.13 57.15,59.69 E2.37
BA1  (via drill 0.81)
  Top 0.406: v97.79,45.72 v97.79,11.43 | v107.31,49.53 107.31,56.52 109.22,58.42 117.47,58.42 U$1.BA1
  Bottom 0.406: E8.9 27.3,14.61 27.3,12.06 70.48,12.06 71.12,11.43 v97.79,11.43 | v97.79,45.72 98.42,46.35 104.14,46.35 v107.31,49.53
BA1W  (via drill 0.81)
  Top 0.406: v85.09,17.78 92.71,25.4 v92.71,64.77 | v74.93,67.31 74.93,69.85 E2.19
  Bottom 0.406: v85.09,17.78 E8.11 | v92.71,64.77 90.17,67.31 v74.93,67.31
BB1  (via drill 0.81)
  Top 0.406: v79.38,26.67 80.64,25.4 91.44,25.4 v91.44,40.64 | v100.33,58.42 v100.33,40.64 | v109.86,57.15 110.49,56.52 110.49,55.88 111.12,55.24 117.47,55.24 U$1.BB1
  Bottom 0.406: E8.7 34.29,24.13 70.48,24.13 73.03,26.67 v79.38,26.67 | v100.33,40.64 v91.44,40.64 | v100.33,58.42 107.31,58.42 108.58,57.15 v109.86,57.15
BB1W  (via drill 0.81)
  Top 0.406: E8.13 47.62,22.86 v47.62,44.45 | v69.85,60.33 72.39,62.87 v72.39,67.31
  Bottom 0.406: v47.62,44.45 50.16,46.99 59.05,46.99 67.31,55.24 67.31,60.33 v69.85,60.33 | v72.39,67.31 72.39,73.66 E2.18
BB2  (via drill 0.81)
  Top 0.406: E1.39 57.78,100.97 v57.78,92.71 | v90.17,74.93 v90.17,92.71 | v93.98,54.61 v93.98,71.12
  Bottom 0.406: v90.17,92.71 v57.78,92.71 | v93.98,71.12 v90.17,74.93 | v93.98,54.61 117.47,54.61 U$1.BB2
BC1  (via drill 0.81)
  Top 0.406: E3.28 62.87,40.01 v62.87,46.35 | v66.04,48.26 67.31,49.53 v67.31,63.5 | v109.86,53.34 109.86,52.07 117.47,52.07 U$1.BC1 | v102.23,53.34 101.6,53.98 v101.6,57.15 | v91.44,57.15 90.17,58.42 v90.17,64.77
  Bottom 0.406: v62.87,46.35 64.77,48.26 v66.04,48.26 | v67.31,63.5 69.85,66.04 E2.14 74.93,64.77 v90.17,64.77 | v102.23,53.34 v109.86,53.34 | v91.44,57.15 v101.6,57.15
BD1  (via drill 0.81)
  Top 0.406: v85.72,66.04 87.63,64.14 v87.63,59.05 | v108.58,55.88 108.58,51.44 111.12,48.9 117.47,48.9 U$1.BD1
  Bottom 0.406: v85.72,66.04 E2.13 | v87.63,59.05 90.81,55.88 v108.58,55.88
BD2  (via drill 0.81)
  Top 0.406: v81.28,40.64 82.55,41.91 82.55,46.35 83.82,47.62 v83.82,50.16
  Bottom 0.406: E3.27 64.77,36.83 64.77,40.64 v81.28,40.64 | v83.82,50.16 84.45,50.8 109.22,50.8 111.12,48.9 117.47,48.9 U$1.BD2
BE1  (via drill 0.81)
  Top 0.406: v104.14,61.59 106.05,59.69 106.05,48.9 109.22,45.72 117.47,45.72 U$1.BE1
  Bottom 0.406: E2.12 74.93,62.23 101.6,62.23 102.23,61.59 v104.14,61.59
BE2  (via drill 0.81)
  Top 0.406: v74.93,43.81 76.2,45.09 v76.2,50.16 | v91.44,48.26 v91.44,52.07
  Bottom 0.406: E3.26 63.5,43.81 v74.93,43.81 | v76.2,50.16 78.11,52.07 v91.44,52.07 | v91.44,48.26 95.25,44.45 110.49,44.45 111.12,45.09 117.47,45.09 U$1.BE2
BF1  (via drill 0.81)
  Top 0.406: E3.25 67.31,36.83 69.85,36.83 v69.85,48.9 | v80.01,48.9 80.01,59.69 E2.11 | v106.05,42.55 117.47,42.55 U$1.BF1
  Bottom 0.406: v69.85,48.9 v80.01,48.9 87,48.9 92.71,43.18 105.41,43.18 v106.05,42.55
BF2  (via drill 0.81)
  Top 0.406: E3.24 67.31,39.37 v67.31,41.91 | v78.74,43.81 78.74,58.42 E2.9 | v83.82,43.18 v83.82,39.37
  Bottom 0.406: v67.31,41.91 67.94,42.55 77.47,42.55 v78.74,43.81 83.19,43.81 v83.82,43.18 | v83.82,39.37 104.78,39.37 107.31,41.91 117.47,41.91 U$1.BF2
BH1  (via drill 0.81)
  Top 0.406: v85.09,38.1 v85.09,57.15 | v109.86,38.1 111.12,39.37 117.47,39.37 U$1.BH1
  Bottom 0.406: E2.8 74.93,57.15 v85.09,57.15 | v109.86,38.1 v85.09,38.1
BH2  (via drill 0.81)
  Top 0.406: v68.58,52.7 E3.22 | E2.4 v71.12,53.34 77.47,53.34 77.47,43.18 v78.74,41.91 | v106.68,39.37 v104.14,41.91
  Bottom 0.406: v68.58,52.7 69.22,53.34 v71.12,53.34 | v104.14,41.91 v78.74,41.91 | v106.68,39.37 117.47,39.37 U$1.BH2
BJ1  (via drill 0.81)
  Top 0.406: v71.12,47.62 E3.20 | v86.36,47.62 88.9,45.09 v88.9,34.29 | v108.58,34.29 110.49,36.2 117.47,36.2 U$1.BJ1
  Bottom 0.406: v86.36,47.62 v71.12,47.62 | v108.58,34.29 v88.9,34.29
BJ2
  Top 0.406: E2.3 69.85,57.15 69.85,50.8 72.39,48.26 72.39,36.83 E3.19
  Bottom 0.406: E3.19 74.93,36.83 110.49,36.83 111.12,36.2 117.47,36.2 U$1.BJ2
BK1  (via drill 0.81)
  Top 0.406: v90.17,33.02 v90.17,54.61 | v109.86,33.02 117.47,33.02 U$1.BK1
  Bottom 0.406: E2.2 69.85,54.61 v90.17,54.61 | v109.86,33.02 v90.17,33.02
BK2  (via drill 0.81)
  Top 0.406: v74.93,29.21 79.38,29.21 v79.38,31.75
  Bottom 0.406: E8.5 34.29,29.21 v74.93,29.21 | v79.38,31.75 110.49,31.75 111.12,32.38 117.47,32.38 U$1.BK2
BK2W  (via drill 0.81)
  Top 0.406: E8.15 43.18,25.4 46.35,25.4 v46.35,59.69 | v64.14,62.23 66.04,60.33 E2.1
  Bottom 0.406: v46.35,59.69 47.62,60.96 56.52,60.96 57.78,62.23 v64.14,62.23
BL1  (via drill 0.81)
  Top 0.406: v66.04,50.16 E2.44 | v72.39,50.16 73.66,48.9 E3.18 80.01,38.1 v80.01,34.29 | v105.41,35.56 111.12,29.84 117.47,29.84 U$1.BL1
  Bottom 0.406: v72.39,50.16 v66.04,50.16 | v80.01,34.29 87,34.29 88.27,35.56 v105.41,35.56
BL2  (via drill 0.81)
  Top 0.406: E2.43 64.77,57.15 v64.77,46.35 v64.77,30.48 | v90.17,29.84 86.36,33.66 v86.36,43.18
  Bottom 0.406: E3.14 v64.77,30.48 | v90.17,29.84 117.47,29.84 U$1.BL2 | v86.36,43.18 83.19,46.35 v64.77,46.35
BM1  (via drill 0.81)
  Top 0.406: v109.86,27.94 111.12,26.67 117.47,26.67 U$1.BM1
  Bottom 0.406: E3.13 77.47,29.21 86.36,29.21 87.63,27.94 v109.86,27.94
BM2  (via drill 0.81)
  Top 0.406: v58.42,38.73 E2.39 | v80.01,39.37 81.92,37.47 v81.92,27.94
  Bottom 0.406: v58.42,38.73 60.33,36.83 61.59,36.83 62.23,36.2 62.23,34.29 66.67,34.29 67.31,34.92 67.31,39.37 v80.01,39.37 | v81.92,27.94 83.19,26.67 117.47,26.67 U$1.BM2
BN1  (via drill 0.81)
  Top 0.406: E3.12 74.93,26.67 74.93,24.77 75.56,24.13 78.74,24.13 v78.74,20.32 | v110.49,21.59 110.49,22.23 111.12,22.86 117.47,22.86 U$1.BN1
  Bottom 0.406: v78.74,20.32 106.05,20.32 107.31,21.59 v110.49,21.59
BN2  (via drill 0.81)
  Top 0.406: v81.28,22.86 E3.11
  Bottom 0.406: v81.28,22.86 117.47,22.86 U$1.BN2
BP1  (via drill 0.81)
  Top 0.406: v105.41,25.4 109.22,21.59 109.22,20.95 109.86,20.32 117.47,20.32 U$1.BP1
  Bottom 0.406: v105.41,25.4 E3.9
BP2  (via drill 0.81)
  Top 0.406: v107.95,20.32 v104.14,24.13
  Bottom 0.406: E3.8 74.93,24.13 v104.14,24.13 | v107.95,20.32 117.47,20.32 U$1.BP2
BR1  (via drill 0.81)
  Top 0.406: E3.7 R1.1 | v110.49,15.24 110.49,15.88 111.12,16.51 117.47,16.51 U$1.BR1
  Bottom 0.406: v110.49,15.24 R1.1
BR2  (via drill 0.81)
  Top 0.406: E3.6 74.93,19.05 v74.93,16.51
  Bottom 0.406: v74.93,16.51 117.47,16.51 U$1.BR2
BS1  (via drill 0.81)
  Top 0.406: v102.87,21.59 109.22,15.24 109.22,14.61 109.86,13.97 117.47,13.97 U$1.BS1
  Bottom 0.406: E3.5 72.39,21.59 v102.87,21.59
BS2  (via drill 0.81)
  Top 0.406: E3.4 73.03,18.41 v73.03,16.51
  Bottom 0.406: v73.03,16.51 75.56,13.97 117.47,13.97 U$1.BS2
BT2  (via drill 0.81)
  Top 0.406: E3.3 69.85,21.59 69.85,16.51 v76.2,10.16
  Bottom 0.406: v76.2,10.16 117.47,10.16 U$1.BT2
BU1  (via drill 0.81)
  Top 0.406: v68.58,10.79 E3.2 | v109.86,8.89 111.12,7.62 117.47,7.62 U$1.BU1
  Bottom 0.406: v68.58,10.79 70.48,8.89 v109.86,8.89
BU2  (via drill 0.81)
  Top 0.406: E3.40 62.23,19.05 v62.23,10.79
  Bottom 0.406: v62.23,10.79 65.41,7.62 117.47,7.62 U$1.BU2
BV1  (via drill 0.81)
  Top 0.406: E3.44 67.31,19.05 v67.31,16.51 | v102.87,12.7 111.12,4.45 117.47,4.45 U$1.BV1
  Bottom 0.406: v67.31,16.51 71.12,12.7 v102.87,12.7
BV2  (via drill 0.81)
  Top 0.406: E3.43 64.77,21.59 v64.77,6.35
  Bottom 0.406: R3.1 54.61,21.59 62.23,21.59 E3.43 | v64.77,6.35 109.22,6.35 111.12,4.45 117.47,4.45 U$1.BV2
C3
  Top 0.406: E3.38 59.69,26.67 59.69,59.69 E2.38
GND  (via drill 0.81)
  Top 0.813: C9.2 17.78,91.44 17.14,92.08 | 17.14,92.08 15.24,93.98 E4.7 | 17.14,92.08 18.41,93.34 18.41,113.67 C11.2 19.05,115.57 v19.05,119.38 | C8.2 34.29,77.47 | 34.29,77.47 E7.1 | E6.10 34.29,95.25 34.29,77.47 | C7.2 E6.1 36.83,115.57 v36.83,96.52 | v102.87,120.65 C1P.- 101.6,110.49 v101.6,79.38 v101.6,73.66 | v109.86,79.38 109.86,80.01 117.47,80.01 U$1.AT1 | v103.5,52.07 103.5,48.9 C3P.- 101.6,46.99 101.6,40.01 100.33,38.73 v100.33,11.43 100.33,4.45 98.42,2.54 61.59,2.54 61.59,9.53 | v106.68,11.43 106.68,10.79 117.47,10.79 U$1.BT1 | E1.37 E1.38 E1.36 | v68.58,106.68 E1.23 | C2.2 56.52,108.58 56.52,106.05 E1.37 | E2.42 E2.40 | v53.34,53.98 C3.2 v55.88,71.12 | v63.5,77.47 E2.26 E2.28 60.33,74.3 60.33,98.42 E1.40 | v70.48,62.87 68.58,64.77 E2.23 | E1.37 56.52,102.23 v56.52,100.97 | 61.59,9.53 60.96,10.16 60.96,12.7 C6.2 55.24,15.24 53.34,13.34 33.02,13.34 E8.10 31.11,19.68 31.11,20.95 E8.8 | 61.59,9.53 63.5,9.53 E3.42 | E3.23 66.04,33.02 66.04,25.4 | E3.1 66.04,25.4 | 66.04,25.4 E3.10 | E7.10 35.56,50.8 v35.56,49.53 C10.2 E8.1 36.83,36.83 36.83,29.21 | E5.7 15.88,62.87 15.88,30.48 17.78,28.57 IC1.GND | E8.8 31.11,24.77 31.11,26.04 E8.6 | 36.83,29.21 34.92,27.3 34.92,24.77 E8.8 | 36.83,29.21 E8.17 | v98.42,70.48 97.79,69.85 v97.79,52.07 | E6.19 43.81,116.84 45.09,118.11 48.9,118.11 v48.9,111.76
  Bottom 0.813: E7.19 38.1,76.2 E7.1 | C7.2 E6.19 45.72,121.92 C1.2 | v36.83,96.52 E6.10 | E6.1 v19.05,119.38 | v102.87,120.65 103.5,121.28 117.47,121.28 U$1.AC2 | v101.6,79.38 v109.86,79.38 | U$1.BC2 117.47,52.07 v103.5,52.07 v97.79,52.07 | v100.33,11.43 v106.68,11.43 | E1.31 C2.2 v48.9,111.76 | E1.38 E1.10 | E1.36 v68.58,106.68 | E2.31 C3.2 | E2.40 59.05,53.98 v53.34,53.98 48.9,49.53 v35.56,49.53 | E1.42 E1.40 58.42,99.06 v56.52,100.97 | v63.5,77.47 C5.2 | E2.26 E2.27 65.41,69.22 66.67,69.22 E2.23 | E2.10 71.75,62.87 v70.48,62.87 | v55.88,71.12 58.42,73.66 E2.28 | E3.42 E3.1 | C10.2 E8.19 | E8.17 C4.2 E3.31 | IC1.GND 19.68,27.94 E8.6 | v98.42,70.48 v101.6,73.66
N$1
  Top 0.406: E1.15 77.47,113.03 77.47,125.09 76.83,125.73 68.58,125.73 SV2.1
N$2  (via drill 0.81)
  Top 0.406: E1.30 62.23,115.57 v62.23,123.19
  Bottom 0.406: v62.23,123.19 69.85,123.19 SV2.2
N$3  (via drill 0.81)
  Top 0.406: v77.47,83.82 v77.47,74.93 | SV1.1 v68.58,83.82
  Bottom 0.406: E2.15 77.47,69.85 v77.47,74.93 | v68.58,83.82 v77.47,83.82
N$4
  Top 0.406: E1.16 72.39,113.03 72.39,123.19 SV2.3
N$5  (via drill 0.81)
  Top 0.406: v51.44,74.93 52.7,76.2 v52.7,78.74
  Bottom 0.406: E2.30 59.69,69.85 52.07,69.85 51.44,70.48 v51.44,74.93 | v52.7,78.74 53.98,80.01 69.85,80.01 SV1.2
N$6  (via drill 0.81)
  Top 0.406: v74.93,74.93 73.66,76.2 SV1.3
  Bottom 0.406: E2.16 74.93,69.85 v74.93,74.93
N$7  (via drill 0.81)
  Top 0.406: SV1.4 v76.2,73.66
  Bottom 0.406: v76.2,73.66 E2.17
N$8
  Top 0.406: SV2.4 E1.17
N$9
  Top 0.406: E3.15 80.64,33.02 80.64,27.3 81.28,26.67 83.82,26.67 SV3.1
N$10
  Bottom 0.406: E3.30 59.69,34.29 59.69,32.38 60.33,31.75 77.47,31.75 78.74,30.48 SV3.2
N$11
  Bottom 0.406: E3.16 74.93,34.29 78.11,34.29 79.38,33.02 SV3.3
N$12
  Bottom 0.406: SV3.4 E3.17
VCC  (via drill 0.81)
  Top 0.813: C3.1 59.05,73.66 59.05,89.53 | 59.05,89.53 59.05,99.69 E1.41 62.87,103.5 62.87,109.86 E1.32 | 59.05,89.53 51.44,97.16 51.44,114.94 C2.1 55.88,119.38 v55.88,123.19 41.27,123.19 34.92,129.54 7.62,129.54 7.62,84.45 3.81,80.64 v3.81,78.11 | v81.28,78.74 83.82,81.28 83.82,122.56 79.38,127 66.67,127 v66.67,124.46 66.67,123.83 68.58,121.92 C1.1 | E2.41 62.87,60.33 62.87,66.67 E2.32 | E2.21 69.85,69.85 v69.85,67.94 | 55.88,17.78 E3.41 62.87,24.77 62.87,31.11 E3.32 | 55.88,17.78 C6.1 | IC1.OUT 22.23,28.57 22.23,12.06 22.86,11.43 28.57,11.43 v28.57,13.34 | R3.2 55.88,27.94 55.88,26.04 | 55.88,17.78 55.88,26.04 | v50.8,38.1 50.8,31.11 55.88,26.04 | v55.88,55.24 55.88,52.7 53.34,50.16 C4.1
  Bottom 0.813: E1.32 68.58,111.76 E1.21 | C5.1 72.39,78.74 v81.28,78.74 | v55.88,123.19 57.15,124.46 v66.67,124.46 | v69.85,67.94 64.77,67.94 64.14,68.58 E2.32 | E3.32 68.58,33.02 E3.21 | v28.57,13.34 30.48,15.24 C6.1 55.24,13.34 64.14,13.34 R1.2 | v50.8,38.1 C4.1 | E2.41 57.78,55.24 v55.88,55.24 | v3.81,78.11 2.54,76.83 2.54,32.38 18.41,32.38 IC1.OUT